# Altium schematic sheet blockdiagram.SchDoc
size A4
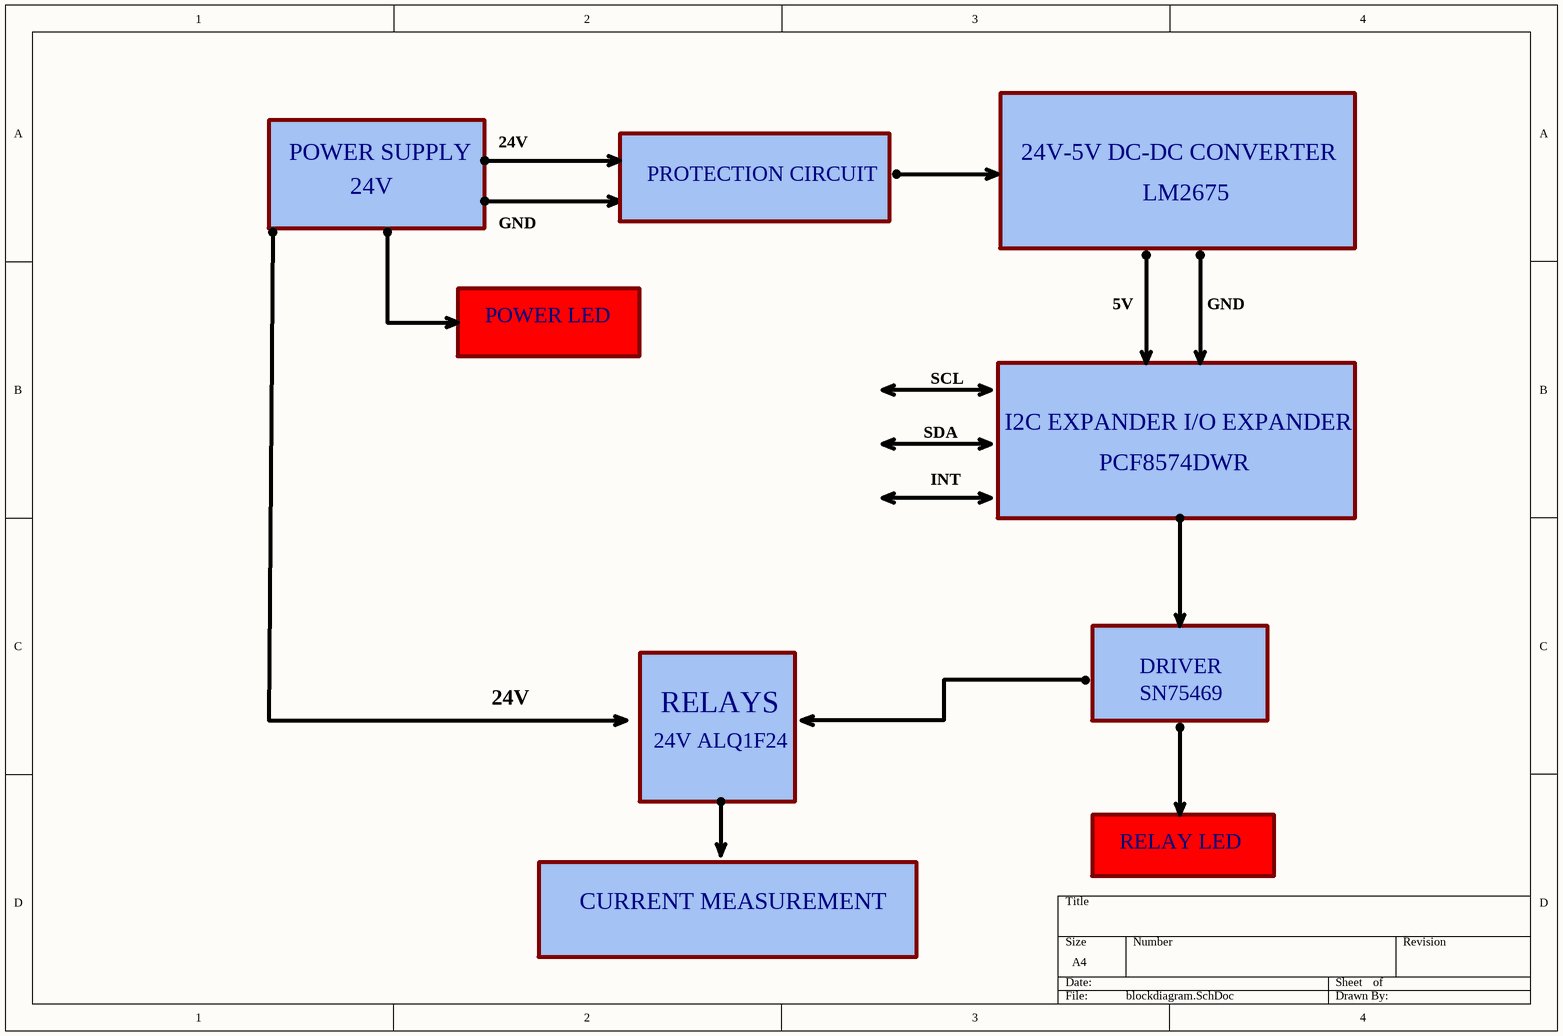
[diagram p0: blockdiagram.SchDoc]

## Notes on the sheet
- POWER SUPPLY
- 24V
- 24V-5V DC-DC CONVERTER
- GND
- PROTECTION CIRCUIT
- LM2675
- 5V
- POWER LED
- SCL
- SDA
- I2C EXPANDER I/O EXPANDER
- INT
- PCF8574DWR
- RELAYS
- DRIVER
- SN75469
- 24V ALQ1F24
- RELAY LED
- CURRENT MEASUREMENT